# EAGLE design TARGET (EAGLE 7.7.0)
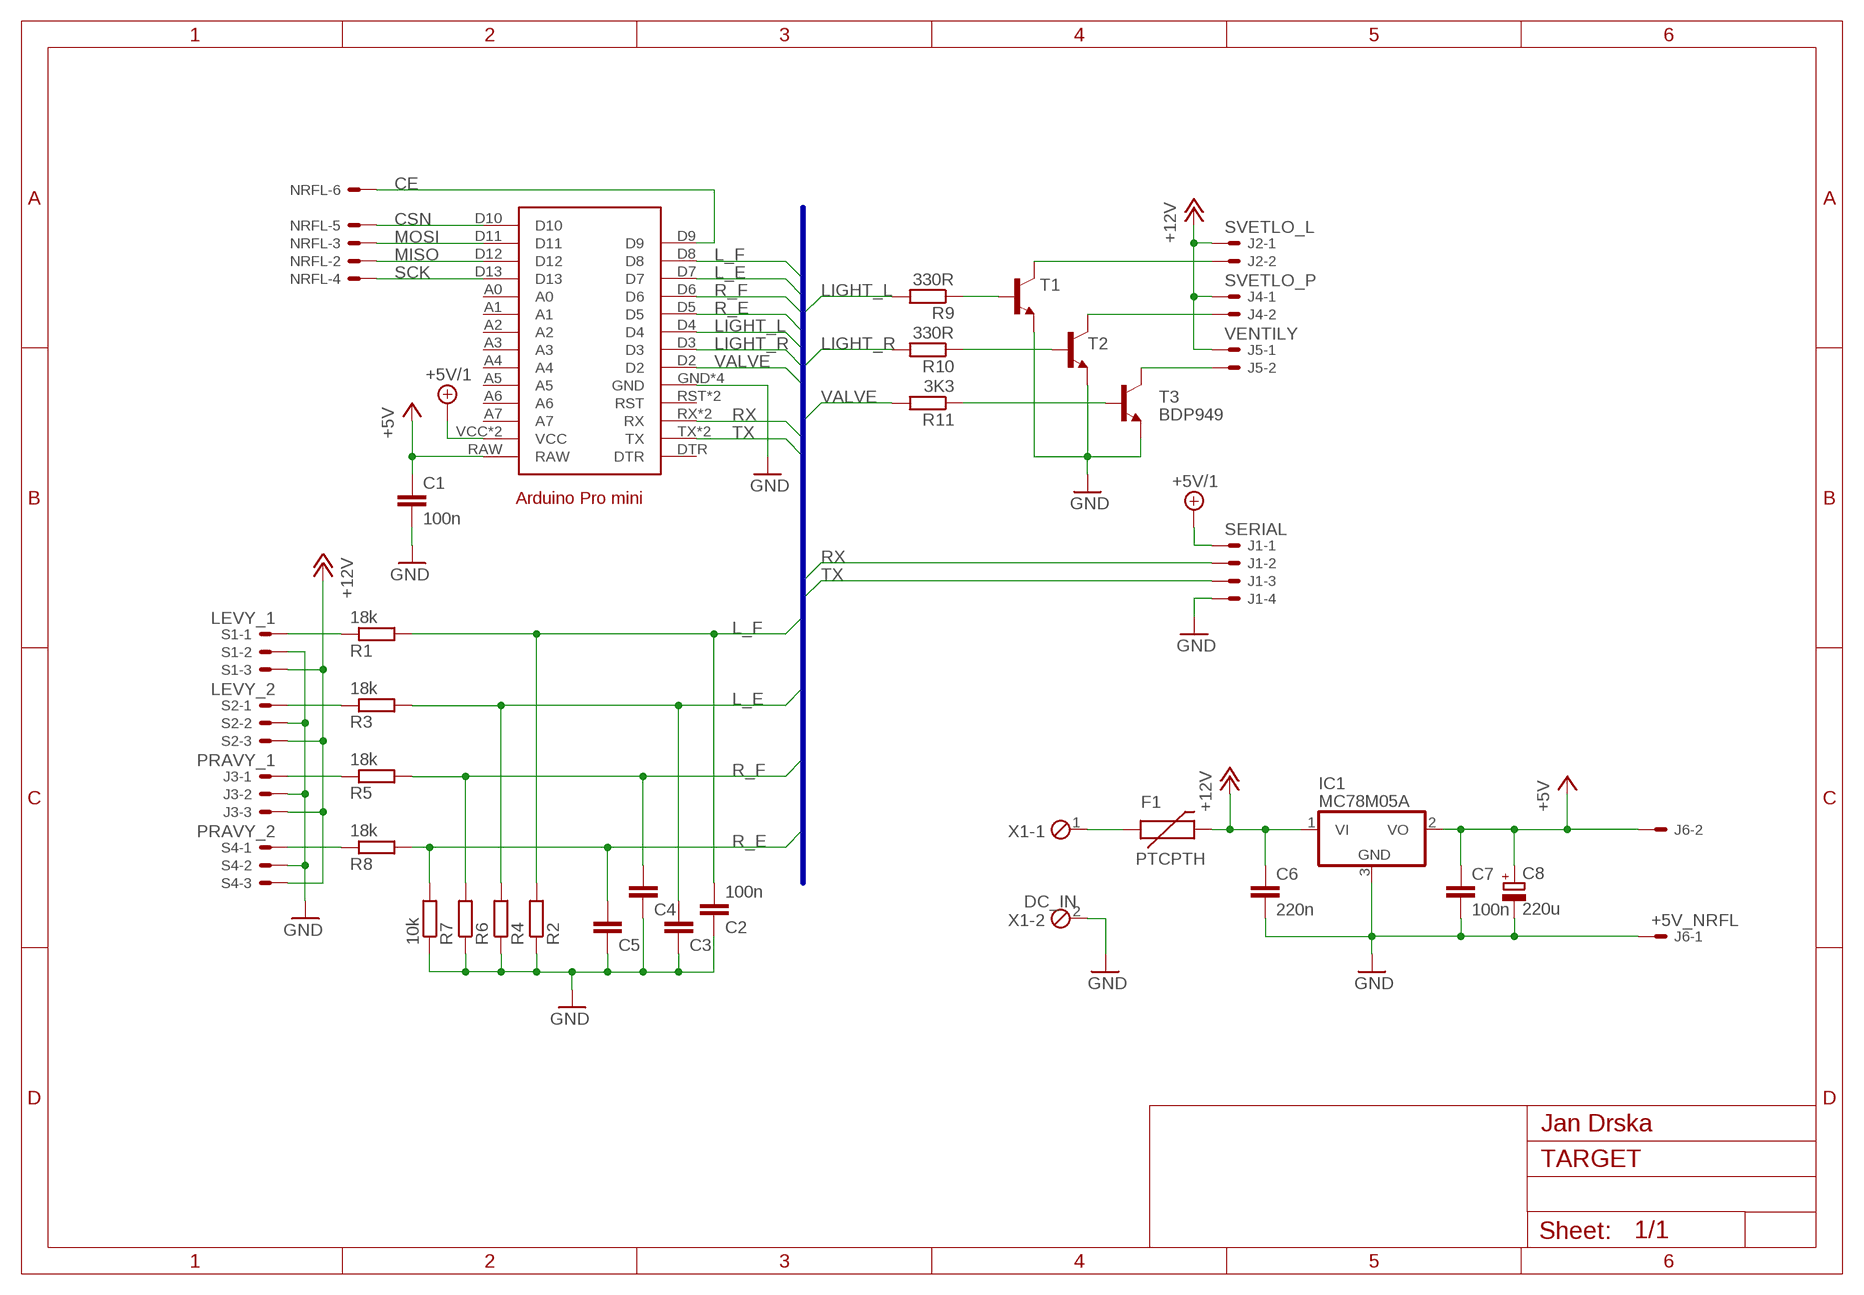
[diagram p0: schematic, sheet 1]

## Parts
ARDUINO1  ARDUINO_PRO_MINI  [ARDUINO_PRO_MINI]
C1  100n  C-EUC0603  [C0603]
C2  100n  C-EUC0603  [C0603]
C3  C-EUC0603  [C0603]
C4  C-EUC0603  [C0603]
C5  C-EUC0603  [C0603]
C6  220n  C-EUC0603  [C0603]
C7  100n  C-EUC0603  [C0603]
C8  220u  CPOL-EUE2,5-6E  [E2,5-6E]
F1  PTCPTH  [PTC]
IC1  MC78M05A  7808DT  [TO252]
J1  SERIAL  22-27-2041-04  [6410-04]
J2  SVETLO_L  22-27-2021-02  [6410-02]
J3  PRAVY_1  22-27-2031-03  [6410-03]
J4  SVETLO_P  22-27-2021-02  [6410-02]
J5  VENTILY  22-27-2021-02  [6410-02]
J6  +5V_NRFL  22-27-2021-02  [6410-02]
NRFL  NRFL  22-27-2061-06  [6410-06]
R1  18k  R-EU_R0603  [R0603]
R2  R-EU_R0603  [R0603]
R3  18k  R-EU_R0603  [R0603]
R4  R-EU_R0603  [R0603]
R5  18k  R-EU_R0603  [R0603]
R6  R-EU_R0603  [R0603]
R7  10k  R-EU_R0603  [R0603]
R8  18k  R-EU_R0603  [R0603]
R9  330R  R-EU_R0603  [R0603]
R10  330R  R-EU_R0603  [R0603]
R11  3K3  R-EU_R0603  [R0603]
S1  LEVY_1  22-27-2031-03  [6410-03]
S2  LEVY_2  22-27-2031-03  [6410-03]
S4  PRAVY_2  22-27-2031-03  [6410-03]
T1  BDP949  -NPN-SOT223  [SOT223]
T2  -NPN-SOT223  [SOT223]
T3  BDP949  -NPN-SOT223  [SOT223]
X1  DC_IN  MPT2  [2POL254]

## Nets
+5V: ARDUINO1.RAW C1.1 C7.1 C8.+ IC1.2(VO) J6.2
+5V/1: ARDUINO1.VCC ARDUINO1.VCC@1(VCC) J1.1
+12V: C6.1 F1.P$2 IC1.1(VI) J2.1 J3.3 J4.1 J5.1 S1.3 S2.3 S4.3
CE: ARDUINO1.D9 NRFL.6
CSN: ARDUINO1.D10 NRFL.5
GND: ARDUINO1.GND ARDUINO1.GND@1(GND) ARDUINO1.GND@2(GND) ARDUINO1.GND@3(GND) C1.2 C2.1 C3.1 C4.1 C5.1 C6.2 C7.2 C8.- IC1.3(GND) J1.4 J3.2 J6.1 R2.1 R4.1 R6.1 R7.1 S1.2 S2.2 S4.2 T1.3(E) T2.3(E) T3.3(E) X1.2
L_E: ARDUINO1.D7 C3.2 R3.2 R4.2
L_F: ARDUINO1.D8 C2.2 R1.2 R2.2
LIGHT_L: ARDUINO1.D4 R9.2
LIGHT_R: ARDUINO1.D3 R10.2
MISO: ARDUINO1.D12 NRFL.2
MOSI: ARDUINO1.D11 NRFL.3
N$1: R1.1 S1.1
N$2: R3.1 S2.1
N$3: R8.1 S4.1
N$4: J3.1 R5.1
N$5: F1.P$1 X1.1
N$14: J2.2 T1.4(C)
N$15: J4.2 T2.4(C)
N$16: J5.2 T3.4(C)
N$17: R11.1 T3.1(B)
N$18: R10.1 T2.1(B)
N$21: R9.1 T1.1(B)
R_E: ARDUINO1.D5 C5.2 R7.2 R8.2
R_F: ARDUINO1.D6 C4.2 R5.2 R6.2
RX: ARDUINO1.RX ARDUINO1.RX@1(RX) J1.2
SCK: ARDUINO1.D13 NRFL.4
TX: ARDUINO1.TX ARDUINO1.TX@1(TX) J1.3
VALVE: ARDUINO1.D2 R11.2
Unconnected: ARDUINO1.A0 ARDUINO1.A1 ARDUINO1.A2 ARDUINO1.A3 ARDUINO1.A4 ARDUINO1.A5 ARDUINO1.A6 ARDUINO1.A7 ARDUINO1.DTR ARDUINO1.RST ARDUINO1.RST@1(RST) NRFL.1

## Buses
CSN,MOSI,MISO,SCK,CE,RX,TX,LIGHT_R,LIGHT_L,VALVE,L_F,L_E,R_F,R_E,GND,+5V,+5V_SERIAL

## Library data of the parts
ARDUINO1 = arduinopromini:ARDUINO_PRO_MINI: For creating Arduino Pro Mini shields
C1-C7 = rcl:C-EU: CAPACITOR, European symbol
C8 = rcl:CPOL-EU: POLARIZED CAPACITOR, European symbol
F1 = SparkFun:PTC: Resettable Fuse PTC Resettable Fuse. Spark Fun Electronics SKU : COM-08357
IC1 = linear:78*: Positive VOLTAGE REGULATOR Source: http://cache.national.com/ds/LM/LM78L05.pdf http://www.fairchildsemi.com/ds/LM/LM7805.pdf
J1 = con-molex:22-?-04: CONNECTOR wire to board 2.54 mm (.1 inch) pitch header; OC_FARNELL: unknown; OC_NEWARK: unknown
J2 J4-J6 = con-molex:22-?-02: CONNECTOR wire to board 2.54 mm (.1 inch) pitch header; OC_FARNELL: unknown; OC_NEWARK: unknown
J3 S1 S2 S4 = con-molex:22-?-03: CONNECTOR wire to board 2.54 mm (.1 inch) pitch header; OC_FARNELL: unknown; OC_NEWARK: unknown
NRFL = con-molex:22-?-06: CONNECTOR wire to board 2.54 mm (.1 inch) pitch header; OC_FARNELL: unknown; OC_NEWARK: unknown
R1-R11 = rcl:R-EU_: RESISTOR, European symbol
T1-T3 = transistor-neu-to92:*-NPN-: NPN Transistror
X1 = con-phoenix-254:MPT2: PHOENIX CONNECTOR; OC_FARNELL: unknown; OC_NEWARK: unknown

## Board
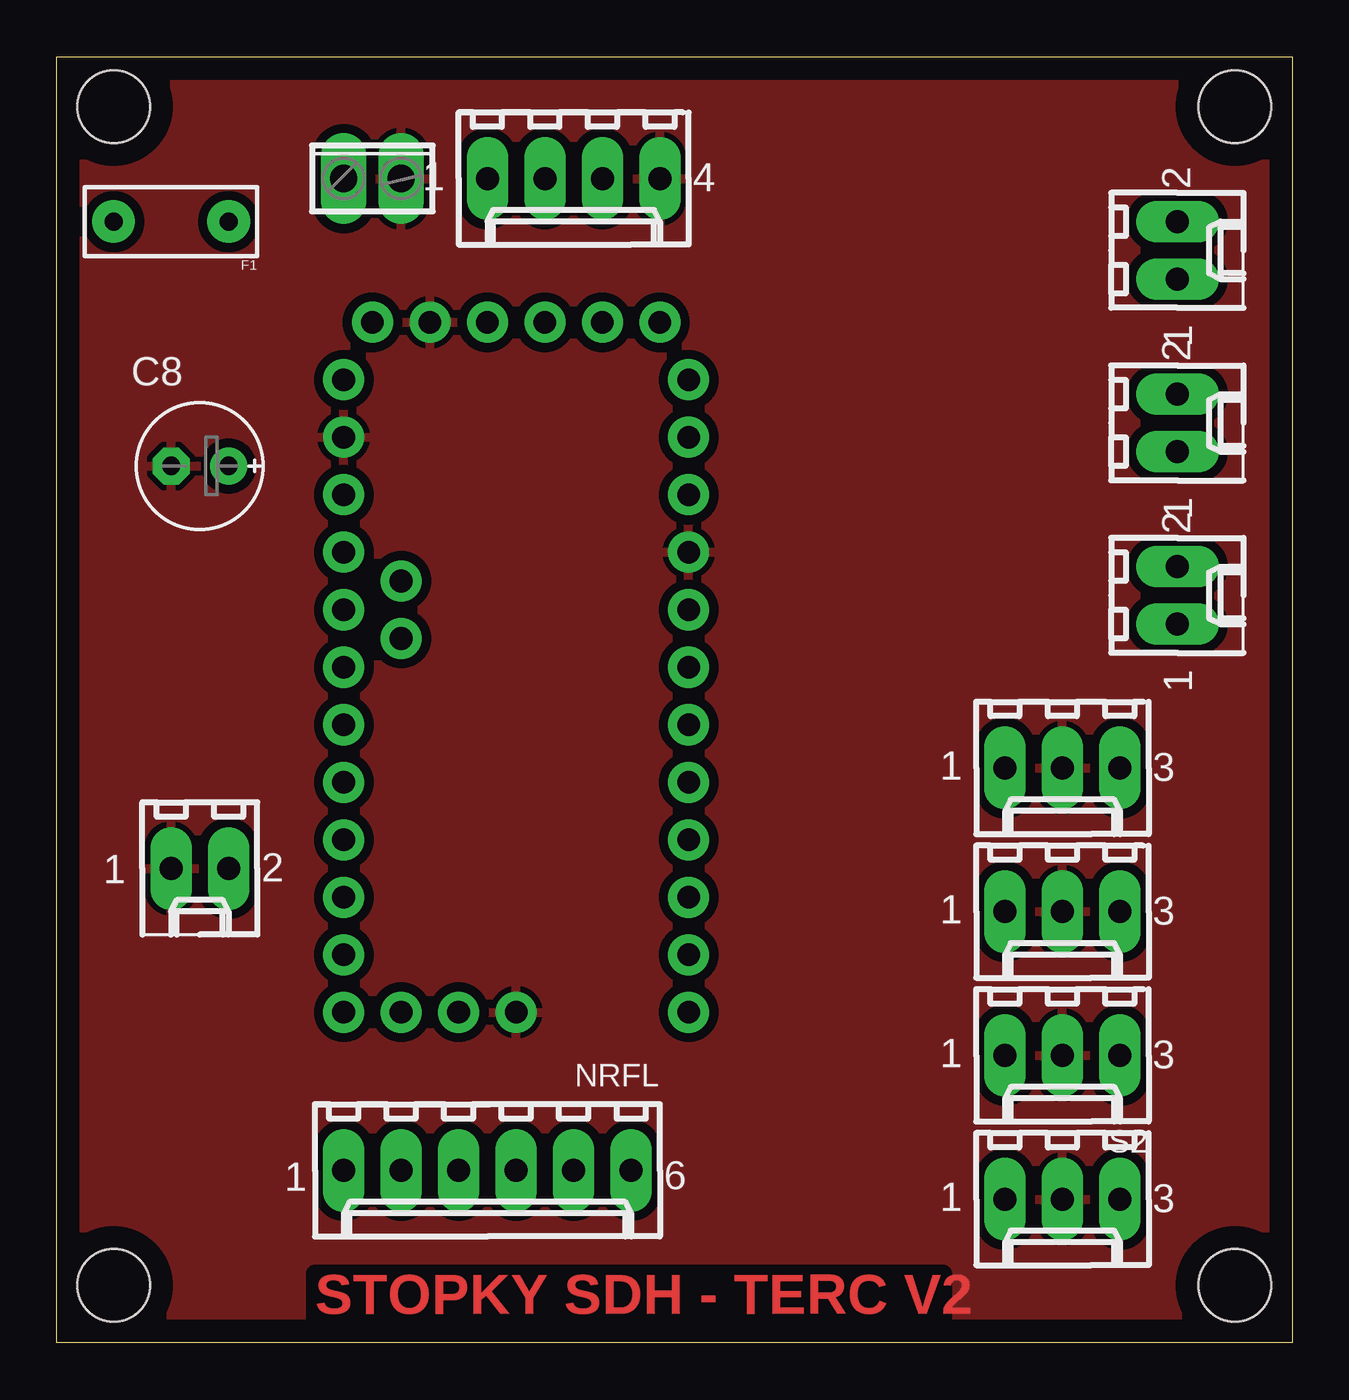
[diagram p1: board, top side]
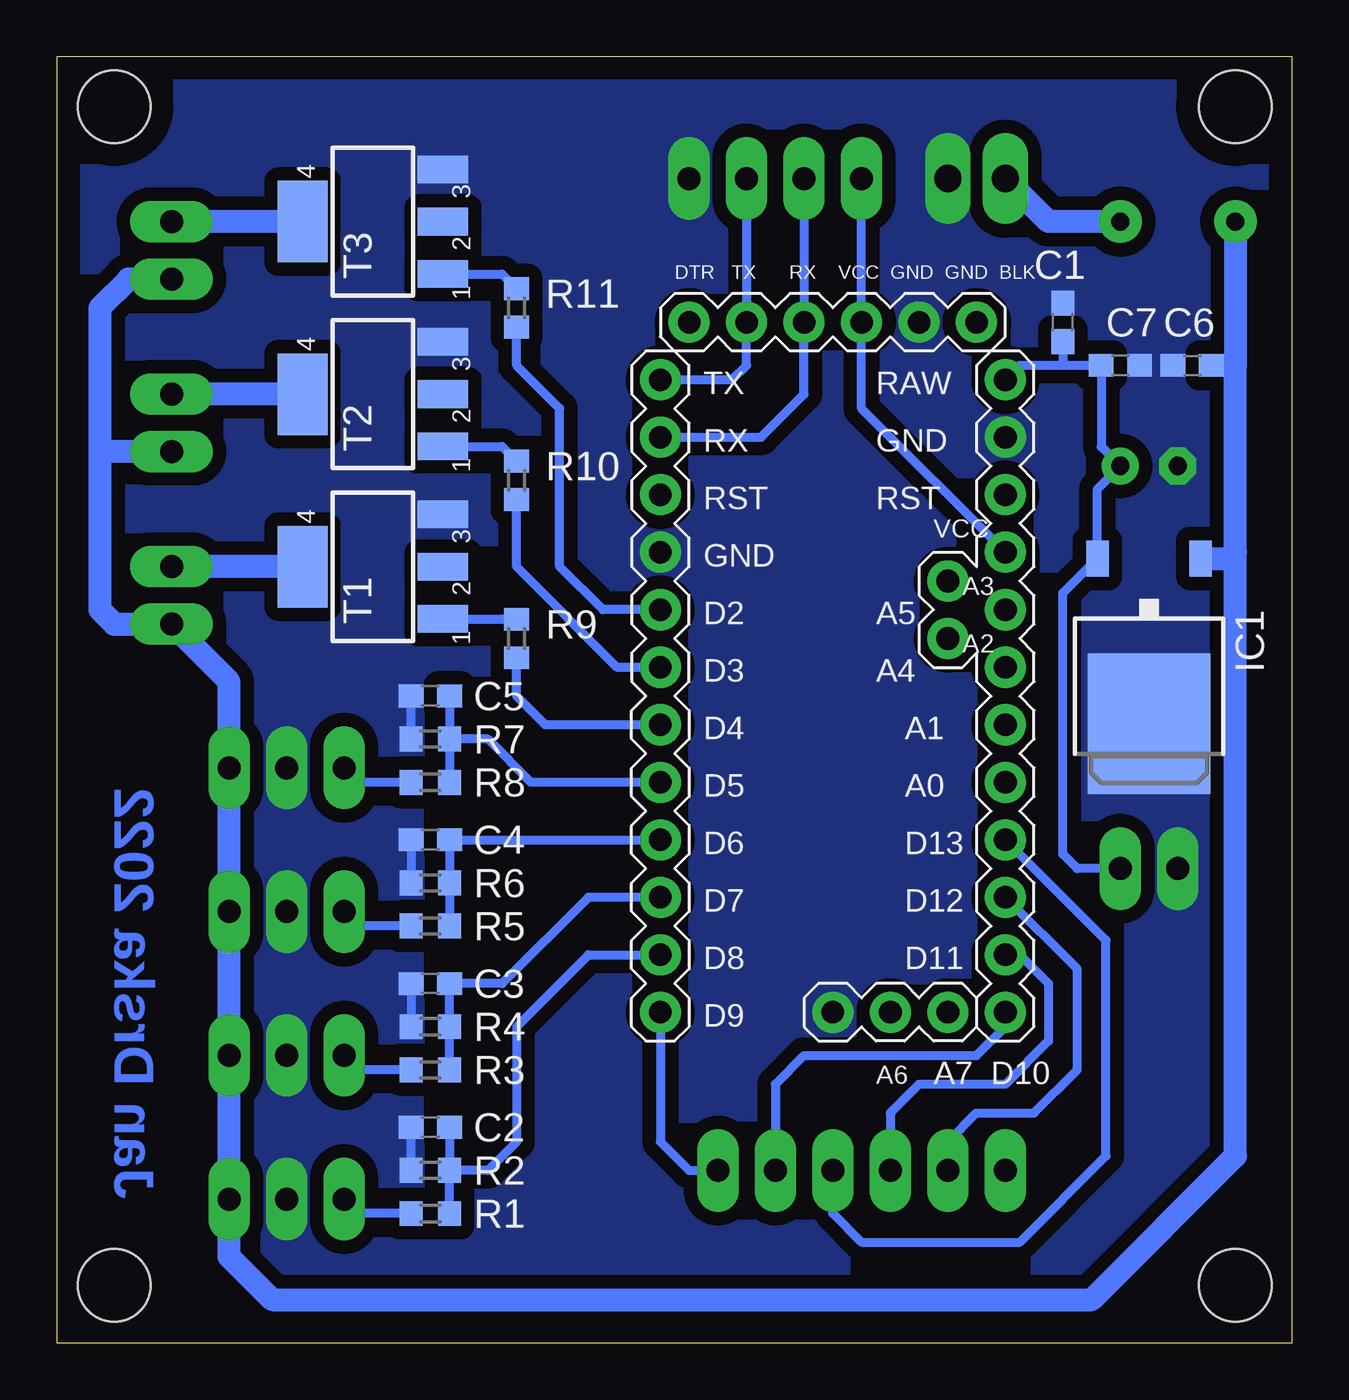
[diagram p2: board, bottom side, seen from below]

Size 54.59 x 56.82 mm. Coordinates in mm from the lower left corner, seen from the top.
Outline: 54.59,0 0,0 0,56.82 54.59,56.82 54.59,0
Copper layers (1*16): Top 0.035mm / dielectric 1.5mm / Bottom 0.035mm
Design rules "VUT": minimum track width 10mil, minimum drill 24mil, track to track 10mil, track to pad 8mil, pad to pad 8mil, via to via 8mil, smd to smd 8mil, copper to edge 40mil, drill to drill 8mil, minimum pad ring 16mil, minimum via ring 16mil, stop-mask expansion 4mil, vias tented up to drill 0mil, thermal gap 10mil
Holes 3.2 mm at 52.05,54.61 2.52,54.61 2.52,2.54 52.05,2.54

### Footprints (pad centres in the part's own frame; a part is rotated, then mirrored left to right if it is on the bottom)
ARDUINO_PRO_MINI = drill 1: A0 11.43,-8.89; A1 11.43,-6.35; A2 11.43,-3.81; A3 11.43,-1.27; A4 8.89,-2.54; A5 8.89,0; A6 6.35,-19.05; A7 8.89,-19.05; BLK 10.16,11.43; D2 -3.81,-1.27; D3 -3.81,-3.81; D4 -3.81,-6.35; D5 -3.81,-8.89; D6 -3.81,-11.43; D7 -3.81,-13.97; D8 -3.81,-16.51; D9 -3.81,-19.05; D10 11.43,-19.05; D11 11.43,-16.51; D12 11.43,-13.97; D13 11.43,-11.43; DTR -2.54,11.43; GND -3.81,1.27; GND@1 11.43,6.35; GND@2 7.62,11.43; GND@3 3.81,-19.05; RAW 11.43,8.89; RST 11.43,3.81; RST@1 -3.81,3.81; RX -3.81,6.35; RX@1 2.54,11.43; TX -3.81,8.89; TX@1 0,11.43; VCC 11.43,1.27; VCC@1 5.08,11.43
C0603 = smd 1.1 x 1: 1 -0.85,0; 2 0.85,0
E2,5-6E = drill 0.813 pad 1.575: + -1.27,0 | drill 0.813 pad 1.575 octagon: - 1.27,0
PTC = drill 0.8 pad 1.88: P$1 -2.54,0; P$2 2.54,0
TO252 = smd 1 x 1.6: 1 -2.28,-4.8; 2 2.28,-4.8 | smd 5.4 x 6.2: 3 0,2.5
6410-04 = drill 1.016 long: 1 3.81,0; 2 1.27,0; 3 -1.27,0; 4 -3.81,0
6410-02 = drill 1.016 long: 1 1.27,0; 2 -1.27,0
6410-03 = drill 1.016 long: 1 2.54,0; 2 0,0; 3 -2.54,0
6410-06 = drill 1.016 long: 1 6.35,0; 2 3.81,0; 3 1.27,0; 4 -1.27,0; 5 -3.81,0; 6 -6.35,0
R0603 = smd 1 x 1.1: 1 -0.85,0; 2 0.85,0
SOT223 = smd 1.219 x 2.235: 1 -2.311,-3.099; 2 0,-3.099; 3 2.311,-3.099 | smd 3.6 x 2.2: 4 0,3.099
2POL254 = drill 1.2 long: 1 -1.27,0; 2 1.27,0

### Placement (x,y rotation side)
ARDUINO1  24.11,33.66 0 bottom
C1  10.14,45.09 90 bottom
C2  38.08,9.53 0 bottom
C3  38.08,15.88 0 bottom
C4  38.08,22.23 0 bottom
C5  38.08,28.57 0 bottom
C6  4.43,43.18 180 bottom
C7  7.6,43.18 0 bottom
C8  6.33,38.73 180 top
F1  5.06,49.53 180 top
IC1  6.33,29.84 180 bottom
J1  22.84,51.44 180 top
J2  49.51,33.02 270 top
J3  44.43,19.05 180 top
J4  49.51,40.64 270 top
J5  49.51,48.26 270 top
J6  6.33,20.95 180 top
NRFL  19.03,7.62 180 top
R1  38.08,5.71 0 bottom
R2  38.08,7.62 0 bottom
R3  38.08,12.06 0 bottom
R4  38.08,13.97 0 bottom
R5  38.08,18.41 0 bottom
R6  38.08,20.32 0 bottom
R7  38.08,26.67 0 bottom
R8  38.08,24.77 0 bottom
R9  34.27,31.11 270 bottom
R10  34.27,38.1 270 bottom
R11  34.27,45.72 270 bottom
S1  44.43,6.35 180 top
S2  44.43,12.7 180 top
S4  44.43,25.4 180 top
T1  40.62,34.29 90 bottom
T2  40.62,41.91 90 bottom
T3  40.62,49.53 90 bottom
X1  13.95,51.44 0 top

### Tracks (layer width: path | path; a pad name or v marks a point on that pad's centre or on a via)
+5V
  Bottom 0.406: 10.14,43.18 C7.1 8.45,39.59 C8.+ 8.61,37.73 IC1.2 10.14,33.12 10.14,21.59 9.51,20.95 J6.2 | 10.14,43.18 12.04,43.18 ARDUINO1.RAW | C1.1 10.14,43.18
+5V/1
  Bottom 0.406: ARDUINO1.VCC 19.03,41.27 ARDUINO1.VCC@1 J1.1
+12V
  Bottom 0.305: C6.1 2.52,43.18
  Bottom 1.016: 2.52,34.92 2.52,8.26 8.87,1.91 45.06,1.91 46.97,3.81 S1.3 S2.3 J3.3 S4.3 46.97,29.21 J2.1 52.05,31.75 52.68,32.38 52.68,39.37 | 2.52,34.92 2.52,43.18 F1.P$2 | IC1.1 2.8,34.65 2.52,34.92 | J5.1 51.41,46.99 52.68,45.72 52.68,39.37 | J4.1 52.68,39.37
CE
  Bottom 0.406: ARDUINO1.D9 27.92,8.89 26.65,7.62 NRFL.6
CSN
  Bottom 0.406: NRFL.5 22.84,11.43 21.57,12.7 13.95,12.7 12.68,13.97 ARDUINO1.D10
GND
  Bottom 0.406: R2.1 C2.1 | C3.1 R4.1 | R7.1 C5.1 | C4.1 R6.1
  pour Bottom (isolate 0.6, no thermals): 54.59,57.15 -0.02,57.15 -0.02,0 54.59,0
  pour Top (isolate 0.406): 54.59,0 -0.02,0 -0.02,57.15 54.59,57.15
L_E
  Bottom 0.406: R3.2 R4.2 C3.2 34.9,15.88 31.09,19.68 ARDUINO1.D7
L_F
  Bottom 0.406: R1.2 R2.2 | C2.2 R2.2 | R2.2 35.54,7.62 34.27,8.89 34.27,13.97 31.09,17.14 ARDUINO1.D8
LIGHT_L
  Bottom 0.406: ARDUINO1.D4 33,27.3 34.27,28.57 R9.2
LIGHT_R
  Bottom 0.406: ARDUINO1.D3 29.82,29.84 34.27,34.29 R10.2
MISO
  Bottom 0.406: ARDUINO1.D12 9.51,16.51 9.51,12.06 11.41,10.16 13.95,10.16 15.22,8.89 NRFL.2
MOSI
  Bottom 0.406: NRFL.3 17.76,10.16 16.49,11.43 12.68,11.43 10.78,13.34 10.78,15.88 12.04,17.14 ARDUINO1.D11
N$1
  Bottom 0.406: R1.1 41.25,5.71 S1.1
N$2
  Bottom 0.406: R3.1 41.25,12.06 S2.1
N$3
  Bottom 0.406: R8.1 41.25,24.77 S4.1
N$4
  Bottom 0.406: R5.1 41.25,18.41 J3.1
N$5
  Bottom 1.016: F1.P$1 10.78,49.53 X1.1
N$14
  Bottom 1.016: T1.4 J2.2
N$15
  Bottom 1.016: T2.4 J4.2
N$16
  Bottom 1.016: T3.4 J5.2
N$17
  Bottom 0.406: T3.1 34.92,47.22 R11.1
N$18
  Bottom 0.406: T2.1 34.92,39.6 R10.1
N$21
  Bottom 0.406: T1.1 34.92,31.98 R9.1
R_E
  Bottom 0.406: R7.2 R8.2 | 37.01,28.79 C5.2 R7.2 | R7.2 35.54,26.67 33.63,24.77 ARDUINO1.D5
R_F
  Bottom 0.406: R5.2 R6.2 C4.2 ARDUINO1.D6
RX
  Bottom 0.406: ARDUINO1.RX 23.48,40.01 21.57,41.91 ARDUINO1.RX@1 J1.2
SCK
  Bottom 0.406: ARDUINO1.D13 8.24,17.78 8.24,8.26 12.04,4.45 19.03,4.45 20.3,5.71 NRFL.4
TX
  Bottom 0.406: ARDUINO1.TX 24.75,42.55 24.11,43.18 ARDUINO1.TX@1 J1.3
VALVE
  Bottom 0.406: ARDUINO1.D2 30.46,32.38 32.36,34.29 32.36,41.27 34.27,43.18 R11.2

### Text on the board
Top: STOPKY SDH - TERC V2
Bottom: Jan Drska 2022